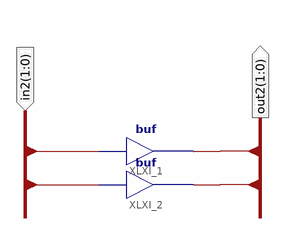
[diagram p0: schematic sheet 1]
// Xilinx ISE schematic buf2.sch (spartan6) as structural Verilog: 2 symbols, 2 ports
module buf2 (
  input  [1:0] in2,
  output [1:0] out2
);

  buf XLXI_1 (out2[1], in2[1]);
  buf XLXI_2 (out2[0], in2[0]);
endmodule
